# EAGLE schematic OpenAir (EAGLE 6.6.0)
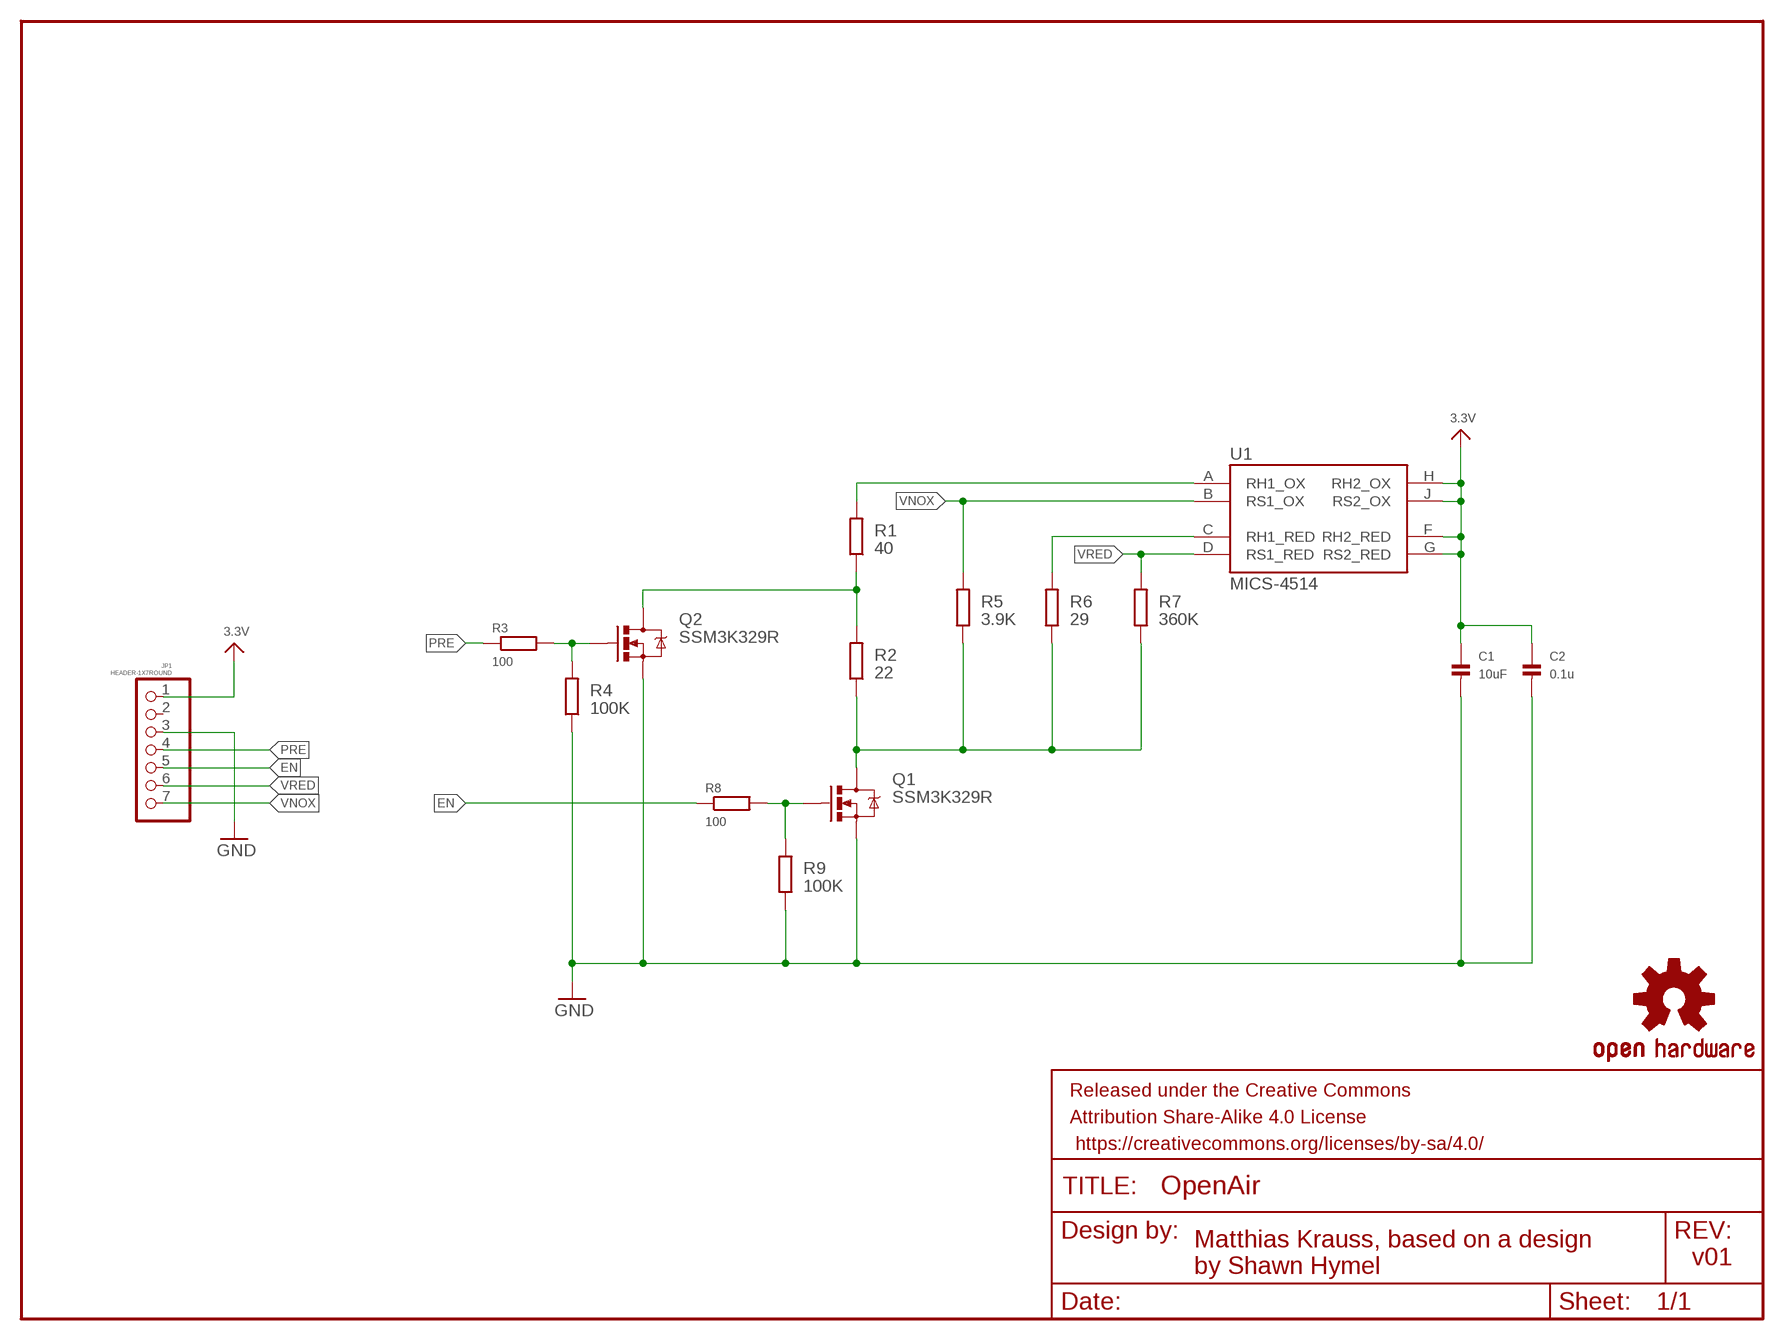
[diagram p0: schematic, sheet 1]

## Parts
C1  10uF  CAP_CERAMIC0603  [0603]
C2  0.1u  CAP_CERAMIC0603  [0603]
FRAME1  FRAME-LETTER  [CREATIVE_COMMONS]
JP1  HEADER-1X7ROUND  [1X07_ROUND]
LOGO1  OSHW-LOGOS  [OSHW-LOGO-S]
Q1  SSM3K329R  MOSFET-NCHANNELBSS138  [SOT23-3]
Q2  SSM3K329R  MOSFET-NCHANNELBSS138  [SOT23-3]
R1  40  R-EU_0603  [0603]
R2  22  R-EU_0603  [0603]
R3  100  R-EU_0603  [0603]
R4  100K  R-EU_0603  [0603]
R5  3.9K  R-EU_0603  [0603]
R6  29  R-EU_0603  [0603]
R7  360K  R-EU_0603  [0603]
R8  100  R-EU_0603  [0603]
R9  100K  R-EU_0603  [0603]
U1  MICS-4514  [MICS_10-SMD]

## Nets
3.3V: C1.1 C2.1 JP1.1 U1.F(RH2_RED) U1.G(RS2_RED) U1.H(RH2_OX) U1.J(RS2_OX)
EN: JP1.5 R8.1
EN_GATE: Q1.1(G) R8.2 R9.2
GND: C1.2 C2.2 JP1.3 Q1.2(S) Q2.2(S) R4.1 R9.1
GND_EN: Q1.3(D) R2.1 R5.1 R6.1 R7.1
N$1: R1.2 U1.A(RH1_OX)
N$2: R6.2 U1.C(RH1_RED)
PRE: JP1.4 R3.1
PREHEAT_GATE: Q2.1(G) R3.2 R4.2
PREHEAT_POWER: Q2.3(D) R1.1 R2.2
VNOX: JP1.7 R5.2 U1.B(RS1_OX)
VRED: JP1.6 R7.2 U1.D(RS1_RED)
Unconnected: JP1.2

## Notes on the sheet
- Matthias Krauss, based on a design 
  by Shawn Hymel
- v01

## Library data of the parts
C1 = everykey:CAP_CERAMIC: Ceramic Capacitors 0603 - 0603 Surface Mount Capacitors 3pF 250V +/-0.1pF RF Ceramic Capacitor[Digikey: 712-1347-1-ND] 16 pF 50V 5% Ceramic Capacitor[Digikey: 445-5051-2-ND] 18 pF 250V 5% RF Ceramic Capcitor [Digikey: 478-3505-1-ND] 22 pF 50V Ceramic Capacitor [Digikey: PCC220ACVTR-ND] 33 pF 50V 5% Ceramic Capacitor 56 pF 250V 5% C0G RF Ceramic Capcitor [Digikey: 490-4867-1-ND] 680 pF 50V Ceramic Capacitor 2200 pF 50V 5% C0G Ceramic Capacitor [Digikey: 445-1297-1-ND] 5600 pF 100V 5% X7R Ceramic Capacitor [Digikey: 478-3711-1-ND] 0.1 µF 25V 10% Ceramic Capacitor [Digikey: PCC2277TR-ND] 0.22 µF 16V 10% X7R Ceramic Capacitor [Digikey: 445-1318-1-ND] 1.0 µF 25V 10% Ceramic Capacitor [Digikey: 445-5146-2-ND] 0805 - 0805 Surface Mount Capacitors 220 pF 250V 2% RF Ceramic Capacitor [Digikey: 712-1398-1-ND] 1000 pF 50V 2% NP0 Ceramic Capacitor [Digikey: 478-3760-1-ND] 0.1 µF 25V 10% Ceramic Capacitor [Digikey: PCC1828TR-ND] 1.0 µF 16V 10% Ceramic Capacitor[Digikey: 490-1691-2-ND] 10.0 µF 10V 10% Ceramic Capacitor[Digikey: 709-1228-1-ND] 1206 - 1206 Surface Mount Capacitors; PROD_ID: CAP-11330
C2 = everykey:CAP_CERAMIC: Ceramic Capacitors 0603 - 0603 Surface Mount Capacitors 3pF 250V +/-0.1pF RF Ceramic Capacitor[Digikey: 712-1347-1-ND] 16 pF 50V 5% Ceramic Capacitor[Digikey: 445-5051-2-ND] 18 pF 250V 5% RF Ceramic Capcitor [Digikey: 478-3505-1-ND] 22 pF 50V Ceramic Capacitor [Digikey: PCC220ACVTR-ND] 33 pF 50V 5% Ceramic Capacitor 56 pF 250V 5% C0G RF Ceramic Capcitor [Digikey: 490-4867-1-ND] 680 pF 50V Ceramic Capacitor 2200 pF 50V 5% C0G Ceramic Capacitor [Digikey: 445-1297-1-ND] 5600 pF 100V 5% X7R Ceramic Capacitor [Digikey: 478-3711-1-ND] 0.1 µF 25V 10% Ceramic Capacitor [Digikey: PCC2277TR-ND] 0.22 µF 16V 10% X7R Ceramic Capacitor [Digikey: 445-1318-1-ND] 1.0 µF 25V 10% Ceramic Capacitor [Digikey: 445-5146-2-ND] 0805 - 0805 Surface Mount Capacitors 220 pF 250V 2% RF Ceramic Capacitor [Digikey: 712-1398-1-ND] 1000 pF 50V 2% NP0 Ceramic Capacitor [Digikey: 478-3760-1-ND] 0.1 µF 25V 10% Ceramic Capacitor [Digikey: PCC1828TR-ND] 1.0 µF 16V 10% Ceramic Capacitor[Digikey: 490-1691-2-ND] 10.0 µF 10V 10% Ceramic Capacitor[Digikey: 709-1228-1-ND] 1206 - 1206 Surface Mount Capacitors
FRAME1 = SparkFun-Aesthetics:FRAME-LETTER: Schematic Frame Standard 8.5x11 US Letter frame
JP1 = everykey:HEADER-1X7
LOGO1 = SparkFun-Aesthetics:OSHW-LOGO: Open Source Hardware Logo This logo indicates the piece of hardware it is found on incorporates a OSHW license and/or adheres to the definition of open source hardware found here: http://freedomdefined.org/OSHW
Q1 Q2 = SparkFun-DiscreteSemi:MOSFET-NCHANNEL: Common NMOSFET Parts MFG P/N Store ID Prod ID FDD8780 TRANS-09984 SI7820DN TRANS-11055 FDS6630A IC-08089 2N7002PW TRANS-11151 FQP30N06L COM-10213 TRANS-10060 BSS123LT1G TRANS-08345 BSS138 TRANS-00830 BS170 2N7000; PROD_ID: TRANS-00830; P_NAME: BSS138
R1 R6 = everykey:R-EU_: RESISTOR, European symbol; DK_ID: 541-82.0CCT-ND
R2 = everykey:R-EU_: RESISTOR, European symbol; PROD_ID: RES-12314
R3-R5 R7-R9 = everykey:R-EU_: RESISTOR, European symbol
U1 = SparkFun-Sensors:MICS-4514: Metal oxide MEMS carbon monoxide (CO) and NOx sensor in an SMD package.; PROD_ID: COMP-12310